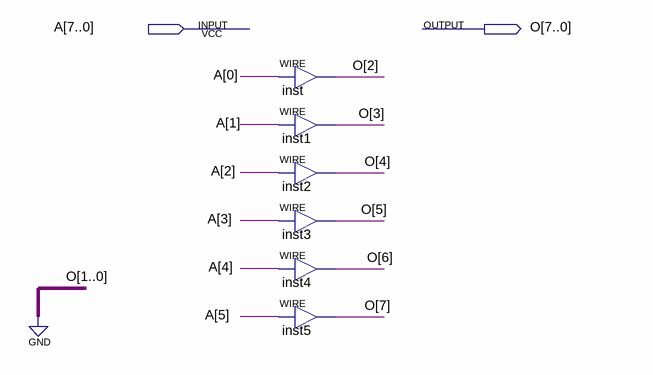
[diagram p0: schematic sheet]
// Quartus schematic g27_8bit_shift_2left.bdf as structural Verilog: 6 symbols, 2 pins
module g27_8bit_shift_2left (
  input  [7:0] A,
  output [7:0] O
);

  assign O[2] = A[0];  // WIRE inst
  assign O[3] = A[1];  // WIRE inst1
  assign O[4] = A[2];  // WIRE inst2
  assign O[5] = A[3];  // WIRE inst3
  assign O[6] = A[4];  // WIRE inst4
  assign O[7] = A[5];  // WIRE inst5

  assign O[1:0] = 2'b00;
endmodule
